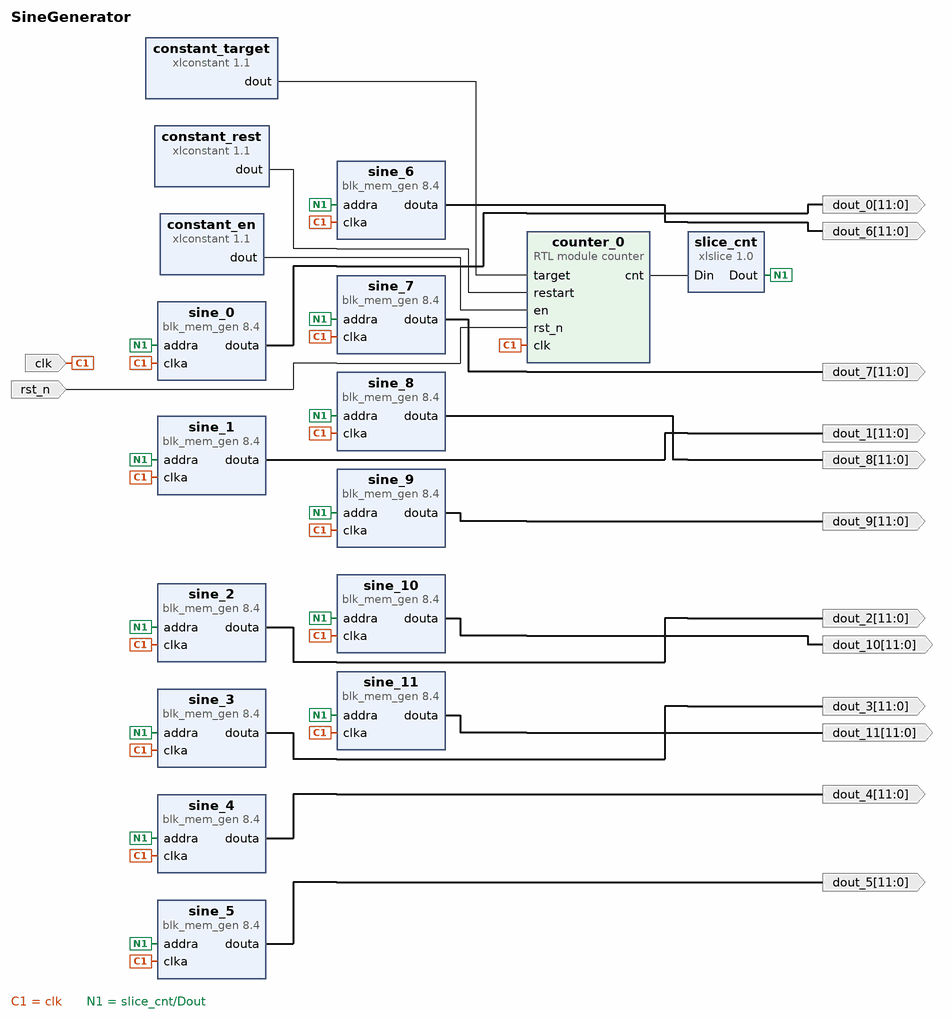
[diagram p0: block diagram of the top level]
# Vivado block design SineGenerator, xczu3eg-sbva484-1-i, Vivado 2020.2
create_bd_design SineGenerator

create_bd_port -dir I -type clk clk
create_bd_port -dir O -from 11 -to 0 dout_0
create_bd_port -dir O -from 11 -to 0 dout_1
create_bd_port -dir O -from 11 -to 0 dout_10
create_bd_port -dir O -from 11 -to 0 dout_11
create_bd_port -dir O -from 11 -to 0 dout_2
create_bd_port -dir O -from 11 -to 0 dout_3
create_bd_port -dir O -from 11 -to 0 dout_4
create_bd_port -dir O -from 11 -to 0 dout_5
create_bd_port -dir O -from 11 -to 0 dout_6
create_bd_port -dir O -from 11 -to 0 dout_7
create_bd_port -dir O -from 11 -to 0 dout_8
create_bd_port -dir O -from 11 -to 0 dout_9
create_bd_port -dir I -type rst rst_n

create_bd_cell -type ip -vlnv xilinx.com:ip:xlconstant:1.1 constant_en
create_bd_cell -type ip -vlnv xilinx.com:ip:xlconstant:1.1 constant_rest
set_property -dict {CONFIG.CONST_VAL 0} [get_bd_cells constant_rest]
create_bd_cell -type ip -vlnv xilinx.com:ip:xlconstant:1.1 constant_target
set_property -dict {CONFIG.CONST_VAL 2031616 CONFIG.CONST_WIDTH 28} [get_bd_cells constant_target]
create_bd_cell -type module -reference counter counter_0
set_property -dict {CONFIG.n_bits 28} [get_bd_cells counter_0]
create_bd_cell -type ip -vlnv xilinx.com:ip:blk_mem_gen:8.4 sine_0
set_property -dict [list \
  CONFIG.Coe_File ../../../../../../../../testing/BufferFlowControl/data/0_sine_0_037878788_0.coe \
  CONFIG.Enable_32bit_Address false \
  CONFIG.Enable_A Always_Enabled \
  CONFIG.Load_Init_File true \
  CONFIG.Memory_Type Single_Port_ROM \
  CONFIG.Port_A_Write_Rate 0 \
  CONFIG.Register_PortA_Output_of_Memory_Primitives true \
  CONFIG.Use_RSTA_Pin false \
  CONFIG.Write_Depth_A 64 \
  CONFIG.Write_Width_A 12 \
  CONFIG.use_bram_block Stand_Alone \
] [get_bd_cells sine_0]
create_bd_cell -type ip -vlnv xilinx.com:ip:blk_mem_gen:8.4 sine_1
set_property -dict [list \
  CONFIG.Coe_File ../../../../../../../../testing/BufferFlowControl/data/1_sine_0_035_0_035_pi_3.coe \
  CONFIG.Enable_32bit_Address false \
  CONFIG.Enable_A Always_Enabled \
  CONFIG.Load_Init_File true \
  CONFIG.Memory_Type Single_Port_ROM \
  CONFIG.Port_A_Write_Rate 0 \
  CONFIG.Register_PortA_Output_of_Memory_Primitives true \
  CONFIG.Use_RSTA_Pin false \
  CONFIG.Write_Depth_A 64 \
  CONFIG.Write_Width_A 12 \
  CONFIG.use_bram_block Stand_Alone \
] [get_bd_cells sine_1]
create_bd_cell -type ip -vlnv xilinx.com:ip:blk_mem_gen:8.4 sine_10
set_property -dict [list \
  CONFIG.Coe_File ../../../../../../../../testing/BufferFlowControl/data/A_sine_1_9_2_pi_3.coe \
  CONFIG.Enable_32bit_Address false \
  CONFIG.Enable_A Always_Enabled \
  CONFIG.Load_Init_File true \
  CONFIG.Memory_Type Single_Port_ROM \
  CONFIG.Port_A_Write_Rate 0 \
  CONFIG.Register_PortA_Output_of_Memory_Primitives true \
  CONFIG.Use_RSTA_Pin false \
  CONFIG.Write_Depth_A 64 \
  CONFIG.Write_Width_A 12 \
  CONFIG.use_bram_block Stand_Alone \
] [get_bd_cells sine_10]
create_bd_cell -type ip -vlnv xilinx.com:ip:blk_mem_gen:8.4 sine_11
set_property -dict [list \
  CONFIG.Coe_File ../../../../../../../../testing/BufferFlowControl/data/B_sine_1_8_0.coe \
  CONFIG.Enable_32bit_Address false \
  CONFIG.Enable_A Always_Enabled \
  CONFIG.Load_Init_File true \
  CONFIG.Memory_Type Single_Port_ROM \
  CONFIG.Port_A_Write_Rate 0 \
  CONFIG.Register_PortA_Output_of_Memory_Primitives true \
  CONFIG.Use_RSTA_Pin false \
  CONFIG.Write_Depth_A 64 \
  CONFIG.Write_Width_A 12 \
  CONFIG.use_bram_block Stand_Alone \
] [get_bd_cells sine_11]
create_bd_cell -type ip -vlnv xilinx.com:ip:blk_mem_gen:8.4 sine_2
set_property -dict [list \
  CONFIG.Coe_File ../../../../../../../../testing/BufferFlowControl/data/2_sine_0_033_0_032_2_pi_3.coe \
  CONFIG.Enable_32bit_Address false \
  CONFIG.Enable_A Always_Enabled \
  CONFIG.Load_Init_File true \
  CONFIG.Memory_Type Single_Port_ROM \
  CONFIG.Port_A_Write_Rate 0 \
  CONFIG.Register_PortA_Output_of_Memory_Primitives true \
  CONFIG.Use_RSTA_Pin false \
  CONFIG.Write_Depth_A 64 \
  CONFIG.Write_Width_A 12 \
  CONFIG.use_bram_block Stand_Alone \
] [get_bd_cells sine_2]
create_bd_cell -type ip -vlnv xilinx.com:ip:blk_mem_gen:8.4 sine_3
set_property -dict [list \
  CONFIG.Coe_File ../../../../../../../../testing/BufferFlowControl/data/3_sine_0_018_pi_3.coe \
  CONFIG.Enable_32bit_Address false \
  CONFIG.Enable_A Always_Enabled \
  CONFIG.Load_Init_File true \
  CONFIG.Memory_Type Single_Port_ROM \
  CONFIG.Port_A_Write_Rate 0 \
  CONFIG.Register_PortA_Output_of_Memory_Primitives true \
  CONFIG.Use_RSTA_Pin false \
  CONFIG.Write_Depth_A 64 \
  CONFIG.Write_Width_A 12 \
  CONFIG.use_bram_block Stand_Alone \
] [get_bd_cells sine_3]
create_bd_cell -type ip -vlnv xilinx.com:ip:blk_mem_gen:8.4 sine_4
set_property -dict [list \
  CONFIG.Coe_File ../../../../../../../../testing/BufferFlowControl/data/4_sine_0_019230769_2_pi_3.coe \
  CONFIG.Enable_32bit_Address false \
  CONFIG.Enable_A Always_Enabled \
  CONFIG.Load_Init_File true \
  CONFIG.Memory_Type Single_Port_ROM \
  CONFIG.Port_A_Write_Rate 0 \
  CONFIG.Register_PortA_Output_of_Memory_Primitives true \
  CONFIG.Use_RSTA_Pin false \
  CONFIG.Write_Depth_A 64 \
  CONFIG.Write_Width_A 12 \
  CONFIG.use_bram_block Stand_Alone \
] [get_bd_cells sine_4]
create_bd_cell -type ip -vlnv xilinx.com:ip:blk_mem_gen:8.4 sine_5
set_property -dict [list \
  CONFIG.Coe_File ../../../../../../../../testing/BufferFlowControl/data/5_sine_0_015_0.coe \
  CONFIG.Enable_32bit_Address false \
  CONFIG.Enable_A Always_Enabled \
  CONFIG.Load_Init_File true \
  CONFIG.Memory_Type Single_Port_ROM \
  CONFIG.Port_A_Write_Rate 0 \
  CONFIG.Register_PortA_Output_of_Memory_Primitives true \
  CONFIG.Use_RSTA_Pin false \
  CONFIG.Write_Depth_A 64 \
  CONFIG.Write_Width_A 12 \
  CONFIG.use_bram_block Stand_Alone \
] [get_bd_cells sine_5]
create_bd_cell -type ip -vlnv xilinx.com:ip:blk_mem_gen:8.4 sine_6
set_property -dict [list \
  CONFIG.Coe_File ../../../../../../../../testing/BufferFlowControl/data/6_sine_0_0033_2_pi_3.coe \
  CONFIG.Enable_32bit_Address false \
  CONFIG.Enable_A Always_Enabled \
  CONFIG.Load_Init_File true \
  CONFIG.Memory_Type Single_Port_ROM \
  CONFIG.Port_A_Write_Rate 0 \
  CONFIG.Register_PortA_Output_of_Memory_Primitives true \
  CONFIG.Use_RSTA_Pin false \
  CONFIG.Write_Depth_A 64 \
  CONFIG.Write_Width_A 12 \
  CONFIG.use_bram_block Stand_Alone \
] [get_bd_cells sine_6]
create_bd_cell -type ip -vlnv xilinx.com:ip:blk_mem_gen:8.4 sine_7
set_property -dict [list \
  CONFIG.Coe_File ../../../../../../../../testing/BufferFlowControl/data/7_sine_0_0031_0.coe \
  CONFIG.Enable_32bit_Address false \
  CONFIG.Enable_A Always_Enabled \
  CONFIG.Load_Init_File true \
  CONFIG.Memory_Type Single_Port_ROM \
  CONFIG.Port_A_Write_Rate 0 \
  CONFIG.Register_PortA_Output_of_Memory_Primitives true \
  CONFIG.Use_RSTA_Pin false \
  CONFIG.Write_Depth_A 64 \
  CONFIG.Write_Width_A 12 \
  CONFIG.use_bram_block Stand_Alone \
] [get_bd_cells sine_7]
create_bd_cell -type ip -vlnv xilinx.com:ip:blk_mem_gen:8.4 sine_8
set_property -dict [list \
  CONFIG.Coe_File ../../../../../../../../testing/BufferFlowControl/data/8_sine_0_00389845_pi_3.coe \
  CONFIG.Enable_32bit_Address false \
  CONFIG.Enable_A Always_Enabled \
  CONFIG.Load_Init_File true \
  CONFIG.Memory_Type Single_Port_ROM \
  CONFIG.Port_A_Write_Rate 0 \
  CONFIG.Register_PortA_Output_of_Memory_Primitives true \
  CONFIG.Use_RSTA_Pin false \
  CONFIG.Write_Depth_A 64 \
  CONFIG.Write_Width_A 12 \
  CONFIG.use_bram_block Stand_Alone \
] [get_bd_cells sine_8]
create_bd_cell -type ip -vlnv xilinx.com:ip:blk_mem_gen:8.4 sine_9
set_property -dict [list \
  CONFIG.Coe_File ../../../../../../../../testing/BufferFlowControl/data/9_sine_2_2_pi_3.coe \
  CONFIG.Enable_32bit_Address false \
  CONFIG.Enable_A Always_Enabled \
  CONFIG.Load_Init_File true \
  CONFIG.Memory_Type Single_Port_ROM \
  CONFIG.Port_A_Write_Rate 0 \
  CONFIG.Register_PortA_Output_of_Memory_Primitives true \
  CONFIG.Use_RSTA_Pin false \
  CONFIG.Write_Depth_A 64 \
  CONFIG.Write_Width_A 12 \
  CONFIG.use_bram_block Stand_Alone \
] [get_bd_cells sine_9]
create_bd_cell -type ip -vlnv xilinx.com:ip:xlslice:1.0 slice_cnt
set_property -dict {CONFIG.DIN_FROM 20 CONFIG.DIN_TO 15 CONFIG.DIN_WIDTH 28 CONFIG.DOUT_WIDTH 6} [get_bd_cells slice_cnt]

# ---- connections ----

connect_bd_net -net clk_0_1 [get_bd_ports clk] \
  [get_bd_pins sine_0/clka] [get_bd_pins sine_11/clka] [get_bd_pins sine_10/clka] [get_bd_pins sine_9/clka] \
  [get_bd_pins sine_8/clka] [get_bd_pins sine_7/clka] [get_bd_pins sine_6/clka] [get_bd_pins sine_5/clka] \
  [get_bd_pins sine_4/clka] [get_bd_pins sine_3/clka] [get_bd_pins sine_2/clka] [get_bd_pins sine_1/clka] \
  [get_bd_pins counter_0/clk]
connect_bd_net -net constant_rest1_dout [get_bd_pins constant_target/dout] [get_bd_pins counter_0/target]
connect_bd_net [get_bd_pins constant_rest/dout] [get_bd_pins counter_0/restart]
connect_bd_net -net rst_n_0_2 [get_bd_ports rst_n] [get_bd_pins counter_0/rst_n]
connect_bd_net [get_bd_pins slice_cnt/Dout] \
  [get_bd_pins sine_0/addra] [get_bd_pins sine_1/addra] [get_bd_pins sine_2/addra] [get_bd_pins sine_3/addra] \
  [get_bd_pins sine_4/addra] [get_bd_pins sine_5/addra] [get_bd_pins sine_6/addra] [get_bd_pins sine_7/addra] \
  [get_bd_pins sine_8/addra] [get_bd_pins sine_9/addra] [get_bd_pins sine_10/addra] [get_bd_pins sine_11/addra]
connect_bd_net -net xlconstant_0_dout [get_bd_pins constant_en/dout] [get_bd_pins counter_0/en]
connect_bd_net [get_bd_pins sine_0/douta] [get_bd_ports dout_0]
connect_bd_net [get_bd_pins sine_1/douta] [get_bd_ports dout_1]
connect_bd_net [get_bd_pins sine_6/douta] [get_bd_ports dout_6]
connect_bd_net [get_bd_pins sine_2/douta] [get_bd_ports dout_2]
connect_bd_net [get_bd_pins sine_7/douta] [get_bd_ports dout_7]
connect_bd_net [get_bd_pins sine_8/douta] [get_bd_ports dout_8]
connect_bd_net [get_bd_pins sine_3/douta] [get_bd_ports dout_3]
connect_bd_net [get_bd_pins sine_4/douta] [get_bd_ports dout_4]
connect_bd_net [get_bd_pins sine_5/douta] [get_bd_ports dout_5]
connect_bd_net [get_bd_pins sine_9/douta] [get_bd_ports dout_9]
connect_bd_net [get_bd_pins sine_10/douta] [get_bd_ports dout_10]
connect_bd_net [get_bd_pins sine_11/douta] [get_bd_ports dout_11]
connect_bd_net [get_bd_pins counter_0/cnt] [get_bd_pins slice_cnt/Din]

validate_bd_design
save_bd_design
